# EAGLE design stm-breakout (EAGLE 9.6.2)

## Sheet 1 of 2: STM32
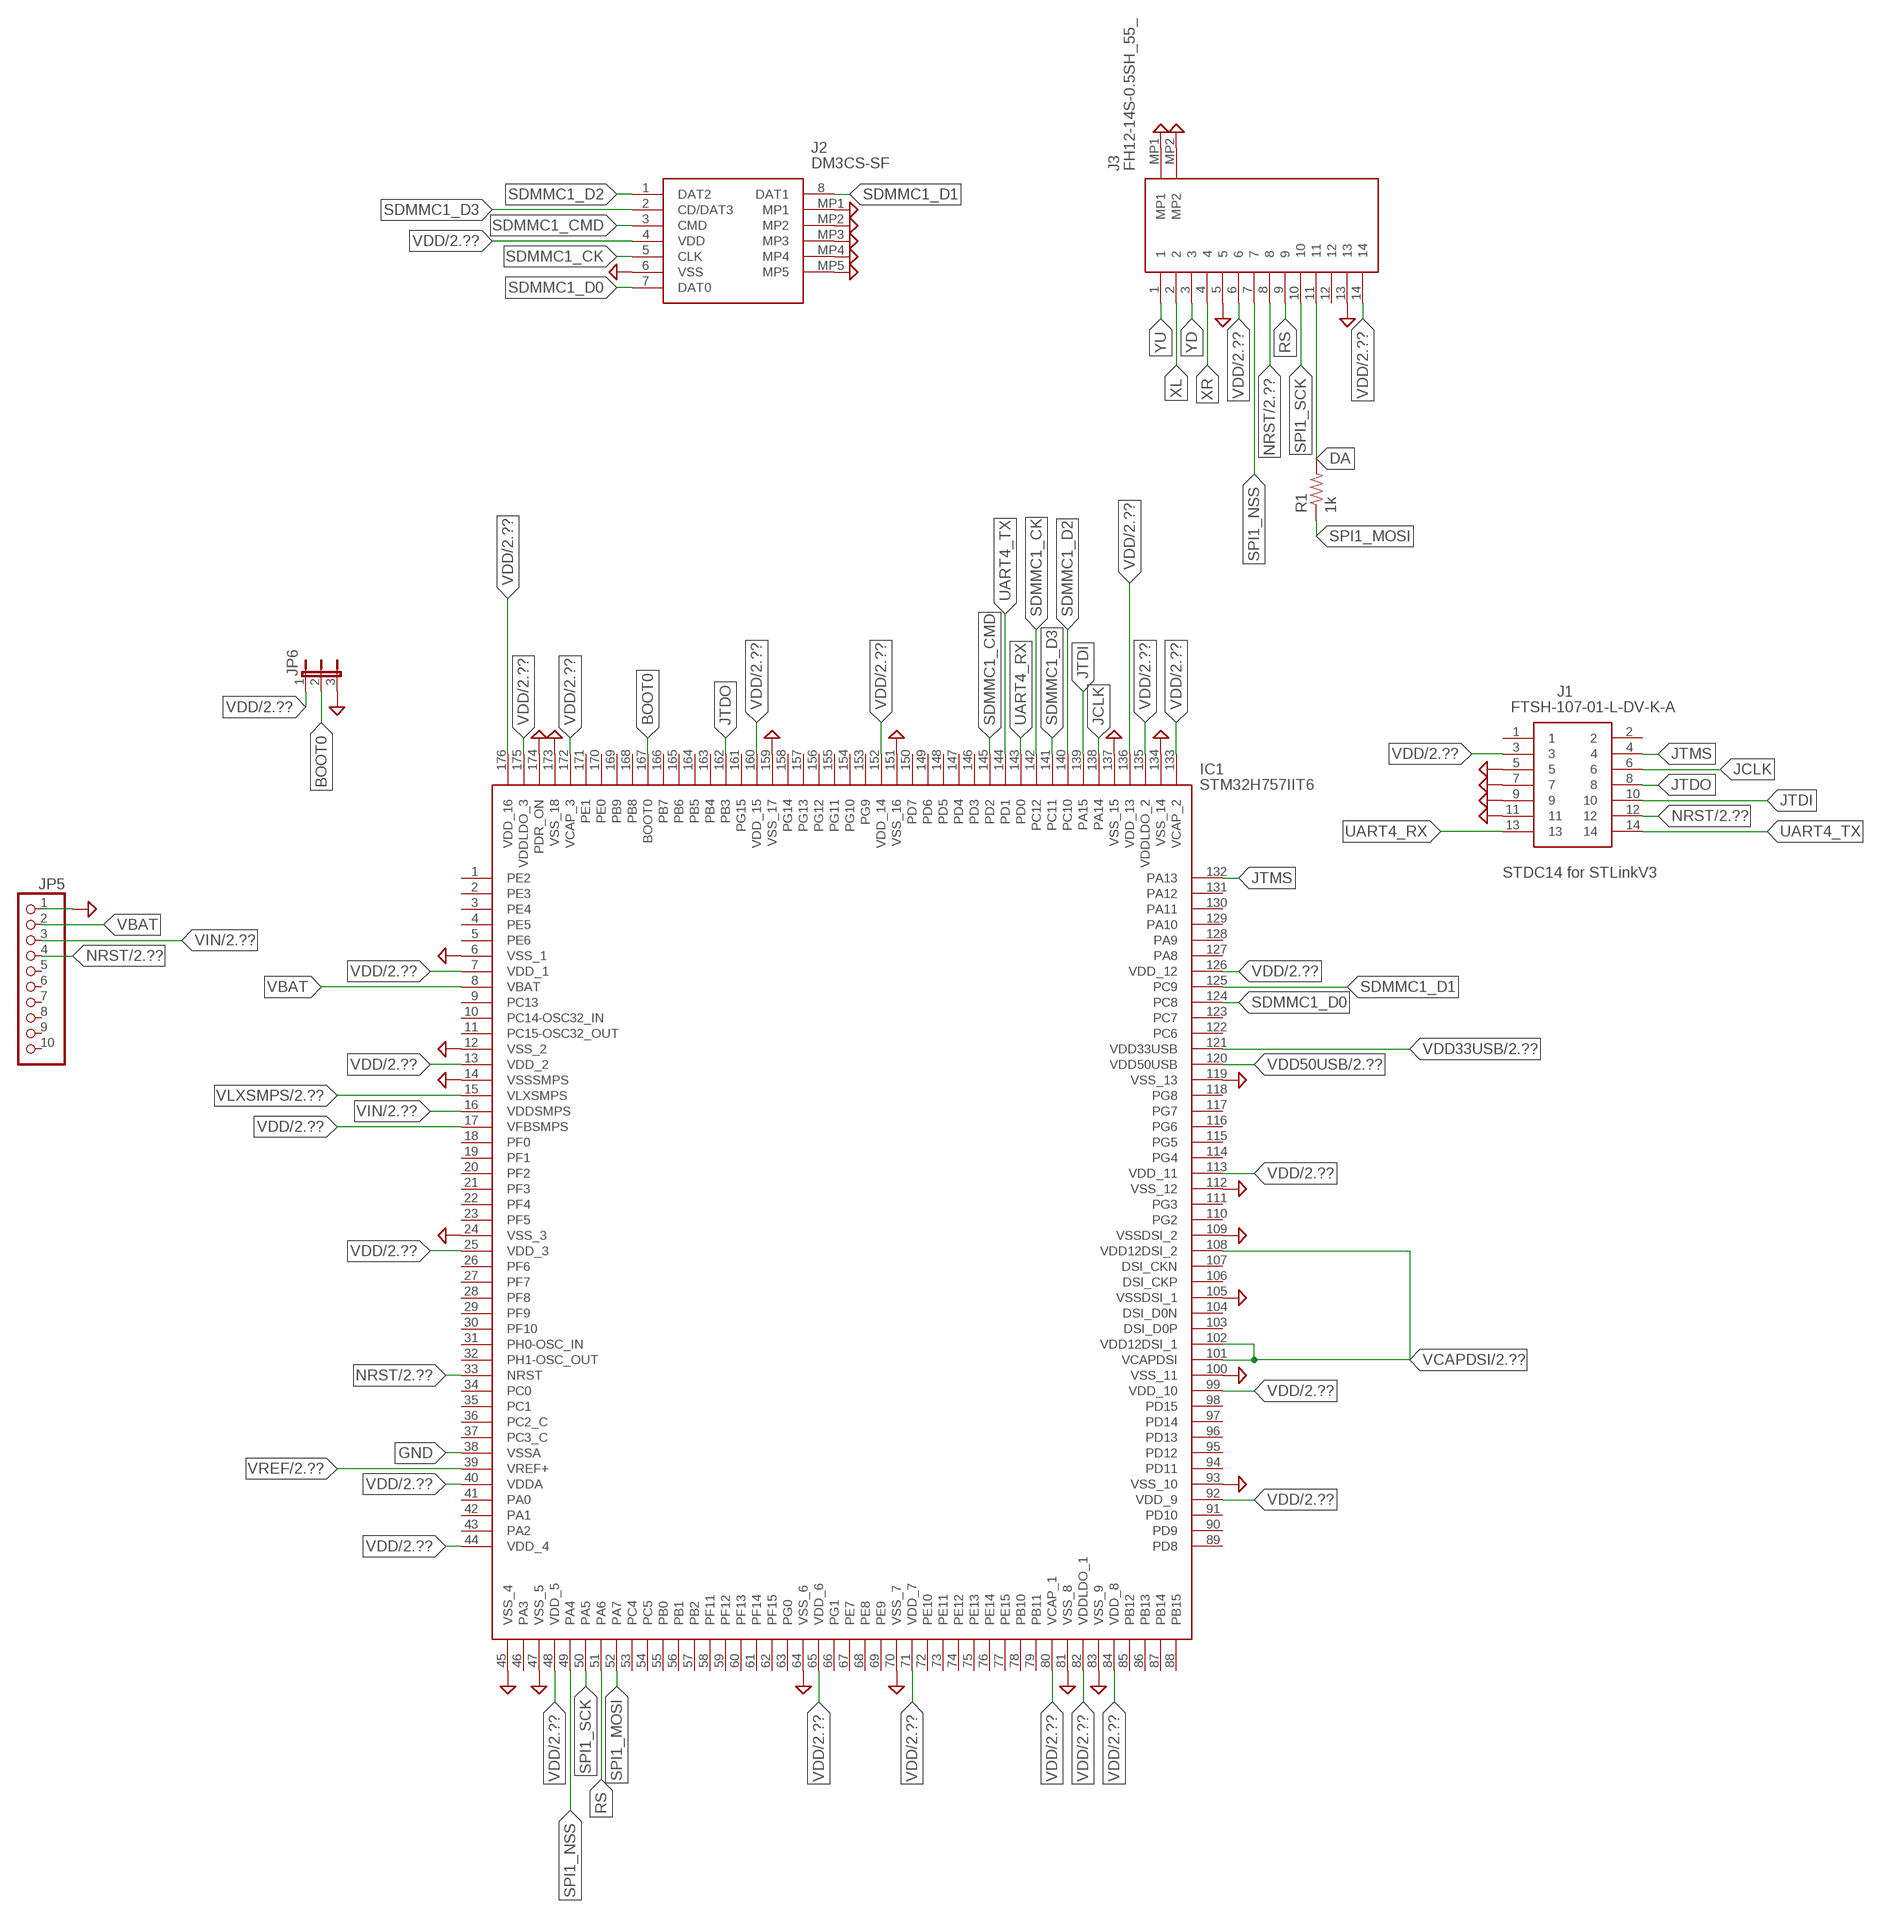
[diagram p0: schematic, sheet 1]

### Parts
IC1  STM32H757IIT6  [QFP50P2600X2600X160-176N]
J1  FTSH-107-01-L-DV-K-A  [FTSH-107-XX-YYY-DV-K-A]
J2  DM3CS-SF  [DM3CSSF]
J3  FH12-14S-0.5SH_55_  [FH1214S05SH55]
JP5  PINHD-1X10  [1X10]
JP6  JP2  [JP2]
R1  1k  R-US_R0402  [R0402]

### Nets
BOOT0: IC1.167(BOOT0) JP6.2
DA: J3.11 R1.2
GND [GND]: IC1.6(VSS_1) IC1.12(VSS_2) IC1.14(VSSSMPS) IC1.24(VSS_3) IC1.38(VSSA) IC1.45(VSS_4) IC1.47(VSS_5) IC1.64(VSS_6) IC1.70(VSS_7) IC1.81(VSS_8) IC1.83(VSS_9) IC1.93(VSS_10) IC1.100(VSS_11) IC1.105(VSSDSI_1) IC1.109(VSSDSI_2) IC1.112(VSS_12) IC1.119(VSS_13) IC1.134(VSS_14) IC1.137(VSS_15) IC1.151(VSS_16) IC1.159(VSS_17) IC1.173(VSS_18) IC1.174(PDR_ON) J1.5 J1.7 J1.9 J1.11 J2.6(VSS) J2.MP1 J2.MP2 J2.MP3 J2.MP4 J2.MP5 J3.5 J3.13 J3.MP1 J3.MP2 JP5.1 JP6.3 ; also sheet 2
JCLK: IC1.138(PA14) J1.6
JTDI: IC1.139(PA15) J1.10
JTDO: IC1.162(PB3) J1.8
JTMS: IC1.132(PA13) J1.4
NRST: IC1.33(NRST) J1.12 J3.8 JP5.4 ; also sheet 2
RS: IC1.51(PA6) J3.9
SDMMC1_CK: IC1.142(PC12) J2.5(CLK)
SDMMC1_CMD: IC1.145(PD2) J2.3(CMD)
SDMMC1_D0: IC1.124(PC8) J2.7(DAT0)
SDMMC1_D1: IC1.125(PC9) J2.8(DAT1)
SDMMC1_D2: IC1.140(PC10) J2.1(DAT2)
SDMMC1_D3: IC1.141(PC11) J2.2(CD/DAT3)
SPI1_MOSI: IC1.52(PA7) R1.1
SPI1_NSS: IC1.49(PA4) J3.7
SPI1_SCK: IC1.50(PA5) J3.10
UART4_RX: IC1.143(PD0) J1.13
UART4_TX: IC1.144(PD1) J1.14
VBAT: IC1.8(VBAT) JP5.2
VCAPDSI: IC1.101(VCAPDSI) IC1.102(VDD12DSI_1) IC1.108(VDD12DSI_2) ; also sheet 2
VDD: IC1.7(VDD_1) IC1.13(VDD_2) IC1.17(VFBSMPS) IC1.25(VDD_3) IC1.40(VDDA) IC1.44(VDD_4) IC1.48(VDD_5) IC1.65(VDD_6) IC1.71(VDD_7) IC1.80(VCAP_1) IC1.82(VDDLDO_1) IC1.84(VDD_8) IC1.92(VDD_9) IC1.99(VDD_10) IC1.113(VDD_11) IC1.126(VDD_12) IC1.133(VCAP_2) IC1.135(VDDLDO_2) IC1.136(VDD_13) IC1.152(VDD_14) IC1.160(VDD_15) IC1.172(VCAP_3) IC1.175(VDDLDO_3) IC1.176(VDD_16) J1.3 J2.4(VDD) J3.6 J3.14 JP6.1 ; also sheet 2
VDD33USB: IC1.121(VDD33USB) ; also sheet 2
VDD50USB: IC1.120(VDD50USB) ; also sheet 2
VIN: IC1.16(VDDSMPS) JP5.3 ; also sheet 2
VLXSMPS: IC1.15(VLXSMPS) ; also sheet 2
VREF: IC1.39(VREF+) ; also sheet 2
XL: J3.2
XR: J3.4
YD: J3.3
YU: J3.1
Unconnected: IC1.1(PE2) IC1.2(PE3) IC1.3(PE4) IC1.4(PE5) IC1.5(PE6) IC1.9(PC13) IC1.10(PC14-OSC32_IN) IC1.11(PC15-OSC32_OUT) IC1.18(PF0) IC1.19(PF1) IC1.20(PF2) IC1.21(PF3) IC1.22(PF4) IC1.23(PF5) IC1.26(PF6) IC1.27(PF7) IC1.28(PF8) IC1.29(PF9) IC1.30(PF10) IC1.31(PH0-OSC_IN) IC1.32(PH1-OSC_OUT) IC1.34(PC0) IC1.35(PC1) IC1.36(PC2_C) IC1.37(PC3_C) IC1.41(PA0) IC1.42(PA1) IC1.43(PA2) IC1.46(PA3) IC1.53(PC4) IC1.54(PC5) IC1.55(PB0) IC1.56(PB1) IC1.57(PB2) IC1.58(PF11) IC1.59(PF12) IC1.60(PF13) IC1.61(PF14) IC1.62(PF15) IC1.63(PG0) IC1.66(PG1) IC1.67(PE7) IC1.68(PE8) IC1.69(PE9) IC1.72(PE10) IC1.73(PE11) IC1.74(PE12) IC1.75(PE13) IC1.76(PE14) IC1.77(PE15) IC1.78(PB10) IC1.79(PB11) IC1.85(PB12) IC1.86(PB13) IC1.87(PB14) IC1.88(PB15) IC1.89(PD8) IC1.90(PD9) IC1.91(PD10) IC1.94(PD11) IC1.95(PD12) IC1.96(PD13) IC1.97(PD14) IC1.98(PD15) IC1.103(DSI_D0P) IC1.104(DSI_D0N) IC1.106(DSI_CKP) IC1.107(DSI_CKN) IC1.110(PG2) IC1.111(PG3) IC1.114(PG4) IC1.115(PG5) IC1.116(PG6) IC1.117(PG7) IC1.118(PG8) IC1.122(PC6) IC1.123(PC7) IC1.127(PA8) IC1.128(PA9) IC1.129(PA10) IC1.130(PA11) IC1.131(PA12) IC1.146(PD3) IC1.147(PD4) IC1.148(PD5) IC1.149(PD6) IC1.150(PD7) IC1.153(PG9) IC1.154(PG10) IC1.155(PG11) IC1.156(PG12) IC1.157(PG13) IC1.158(PG14) IC1.161(PG15) IC1.163(PB4) IC1.164(PB5) IC1.165(PB6) IC1.166(PB7) IC1.168(PB8) IC1.169(PB9) IC1.170(PE0) IC1.171(PE1) J1.1 J1.2 J3.12 JP5.5 JP5.6 JP5.7 JP5.8 JP5.9 JP5.10

### Notes on the sheet
- STDC14 for STLinkV3

## Sheet 2 of 2: Power and Decoupling
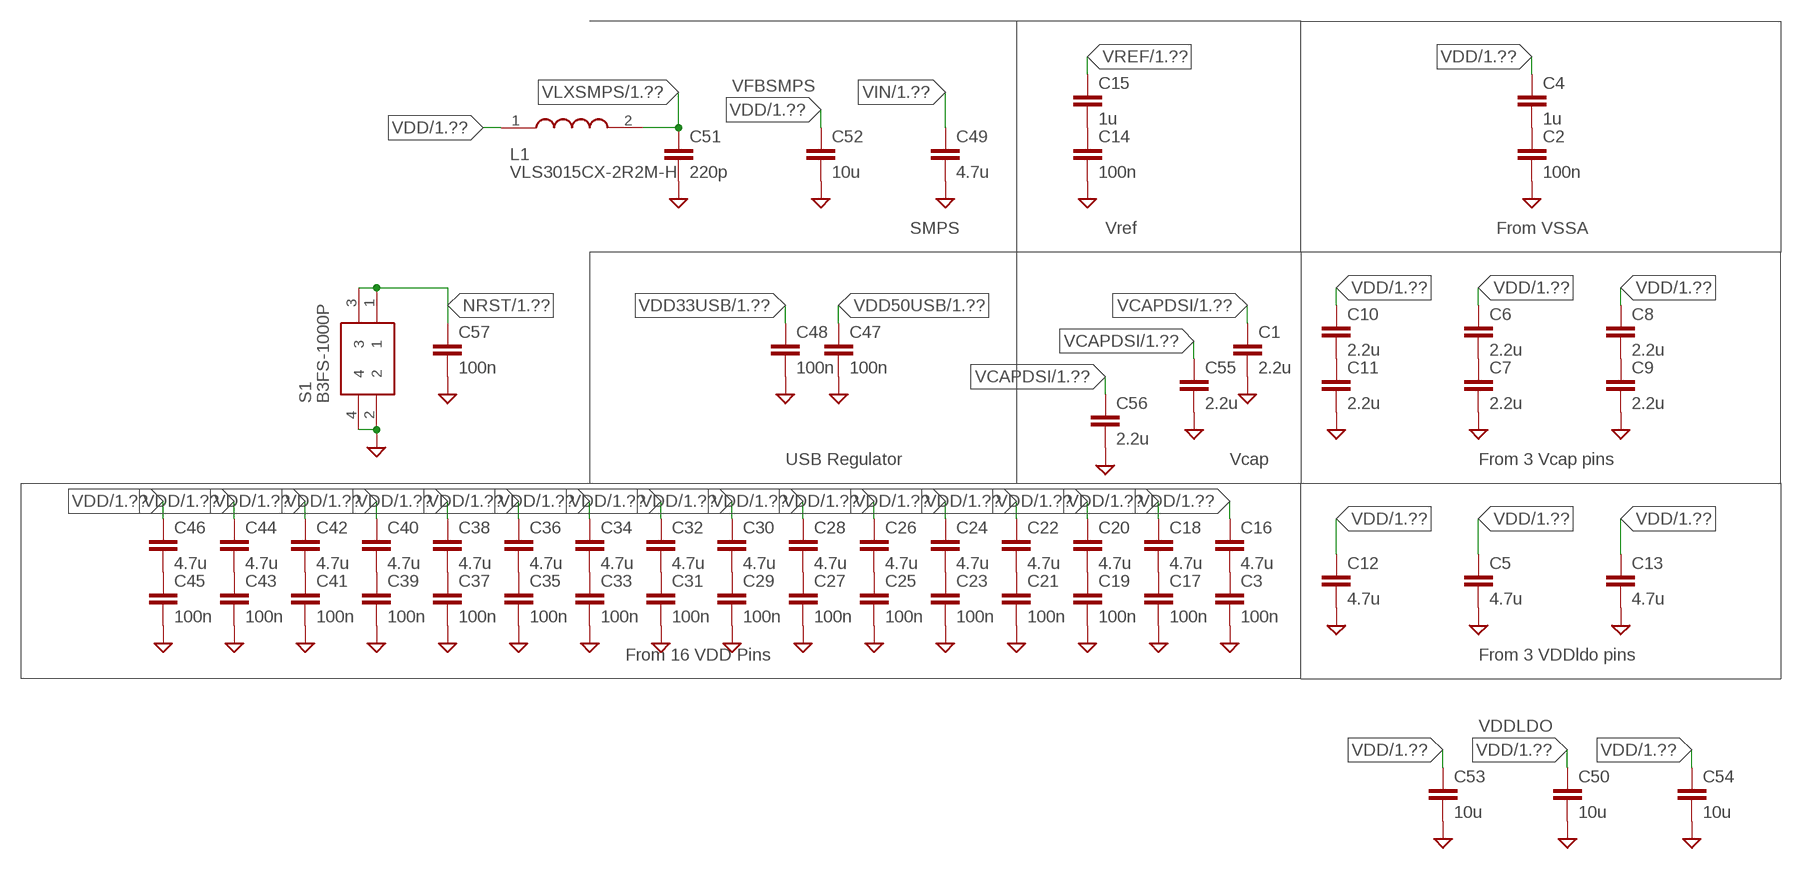
[diagram p1: schematic, sheet 2]

### Parts
C1  2.2u  C-EUC0603  [C0603]
C2  100n  C-EUC0402  [C0402]
C3  100n  C-EUC0402  [C0402]
C4  1u  C-EUC0603  [C0603]
C5  4.7u  C-EUC0603  [C0603]
C6  2.2u  C-EUC0603  [C0603]
C7  2.2u  C-EUC0603  [C0603]
C8  2.2u  C-EUC0603  [C0603]
C9  2.2u  C-EUC0603  [C0603]
C10  2.2u  C-EUC0603  [C0603]
C11  2.2u  C-EUC0603  [C0603]
C12  4.7u  C-EUC0603  [C0603]
C13  4.7u  C-EUC0603  [C0603]
C14  100n  C-EUC0402  [C0402]
C15  1u  C-EUC0603  [C0603]
C16  4.7u  C-EUC0603  [C0603]
C17  100n  C-EUC0402  [C0402]
C18  4.7u  C-EUC0603  [C0603]
C19  100n  C-EUC0402  [C0402]
C20  4.7u  C-EUC0603  [C0603]
C21  100n  C-EUC0402  [C0402]
C22  4.7u  C-EUC0603  [C0603]
C23  100n  C-EUC0402  [C0402]
C24  4.7u  C-EUC0603  [C0603]
C25  100n  C-EUC0402  [C0402]
C26  4.7u  C-EUC0603  [C0603]
C27  100n  C-EUC0402  [C0402]
C28  4.7u  C-EUC0603  [C0603]
C29  100n  C-EUC0402  [C0402]
C30  4.7u  C-EUC0603  [C0603]
C31  100n  C-EUC0402  [C0402]
C32  4.7u  C-EUC0603  [C0603]
C33  100n  C-EUC0402  [C0402]
C34  4.7u  C-EUC0603  [C0603]
C35  100n  C-EUC0402  [C0402]
C36  4.7u  C-EUC0603  [C0603]
C37  100n  C-EUC0402  [C0402]
C38  4.7u  C-EUC0603  [C0603]
C39  100n  C-EUC0402  [C0402]
C40  4.7u  C-EUC0603  [C0603]
C41  100n  C-EUC0402  [C0402]
C42  4.7u  C-EUC0603  [C0603]
C43  100n  C-EUC0402  [C0402]
C44  4.7u  C-EUC0603  [C0603]
C45  100n  C-EUC0402  [C0402]
C46  4.7u  C-EUC0603  [C0603]
C47  100n  C-EUC0402  [C0402]
C48  100n  C-EUC0402  [C0402]
C49  4.7u  C-EUC0603  [C0603]
C50  10u  C-EUC0603  [C0603]
C51  220p  C-EUC0402  [C0402]
C52  10u  C-EUC0603  [C0603]
C53  10u  C-EUC0603  [C0603]
C54  10u  C-EUC0603  [C0603]
C55  2.2u  C-EUC0603  [C0603]
C56  2.2u  C-EUC0603  [C0603]
C57  100n  C-EUC0402  [C0402]
L1  VLS3015CX-2R2M-H  [VLS3015]
S1  B3FS-1000P  [B3FS-1000P]

### Nets
GND [GND]: C1.2 C2.2 C3.2 C5.2 C7.2 C9.2 C11.2 C12.2 C13.2 C14.2 C17.2 C19.2 C21.2 C23.2 C25.2 C27.2 C29.2 C31.2 C33.2 C35.2 C37.2 C39.2 C41.2 C43.2 C45.2 C47.2 C48.2 C49.2 C50.2 C51.2 C52.2 C53.2 C54.2 C55.2 C56.2 C57.2 S1.2 S1.4 ; also sheet 1
N$1: C2.1 C4.2
N$2: C6.2 C7.1
N$3: C8.2 C9.1
N$4: C10.2 C11.1
NRST: C57.1 S1.1 S1.3 ; also sheet 1
VCAPDSI: C1.1 C55.1 C56.1 ; also sheet 1
VDD: C4.1 C5.1 C6.1 C8.1 C10.1 C12.1 C13.1 C16.1 C18.1 C20.1 C22.1 C24.1 C26.1 C28.1 C30.1 C32.1 C34.1 C36.1 C38.1 C40.1 C42.1 C44.1 C46.1 C50.1 C52.1 C53.1 C54.1 L1.1 ; also sheet 1
VDD33USB: C48.1 ; also sheet 1
VDD50USB: C47.1 ; also sheet 1
VIN: C49.1 ; also sheet 1
VLXSMPS: C51.1 L1.2 ; also sheet 1
VREF: C15.1 ; also sheet 1
VREFNF: C14.1 C15.2
VREFNF1: C3.1 C16.2
VREFNF2: C17.1 C18.2
VREFNF3: C19.1 C20.2
VREFNF4: C21.1 C22.2
VREFNF5: C23.1 C24.2
VREFNF6: C25.1 C26.2
VREFNF7: C27.1 C28.2
VREFNF8: C29.1 C30.2
VREFNF9: C31.1 C32.2
VREFNF10: C33.1 C34.2
VREFNF11: C35.1 C36.2
VREFNF12: C37.1 C38.2
VREFNF13: C39.1 C40.2
VREFNF14: C41.1 C42.2
VREFNF15: C43.1 C44.2
VREFNF16: C45.1 C46.2

### Notes on the sheet
- VFBSMPS
- SMPS | Vref | From VSSA
- USB Regulator | Vcap | From 3 Vcap pins
- From 16 VDD Pins | From 3 VDDldo pins
- VDDLDO

## Library data of the parts
C1-C57 = rcl:C-EU: CAPACITOR, European symbol; SPICEPREFIX: C
IC1 = SamacSys_Parts:STM32H757IIT6: ARM Microcontrollers - MCU 16/32-BITS MICROS Source: Datasheet <https://www.st.com/resource/en/datasheet/stm32h757ai.pdf>; DESCRIPTION: ARM Microcontrollers - MCU 16/32-BITS MICROS; HEIGHT: 1.6mm; MANUFACTURER_NAME: STMicroelectronics; MANUFACTURER_PART_NUMBER: STM32H757IIT6; MOUSER_PART_NUMBER: 511-STM32H757IIT6; MOUSER_PRICE-STOCK: https://www.mouser.co.uk/ProductDetail/STMicroelectronics/STM32H757IIT6?qs=vLWxofP3U2wz9EzH5pjPxQ%3D%3D
J1 = SamacSys_Parts:FTSH-107-01-L-DV-K-A: 14 position, High Reliability Header Strips, 0.050" pitch, Dual-Row Vertical Source: Datasheet <http://suddendocs.samtec.com/prints/ftsh-1xx-xx-xxx-dv-xxx-xxx-mkt.pdf>; DESCRIPTION: 14 position, High Reliability Header Strips, 0.050&quot; pitch, Dual-Row Vertical; HEIGHT: mm; MANUFACTURER_NAME: SAMTEC; MANUFACTURER_PART_NUMBER: FTSH-107-01-L-DV-K-A; MOUSER_PART_NUMBER: 200-FTSH10701LDVKA; MOUSER_PRICE-STOCK: https://www.mouser.co.uk/ProductDetail/Samtec/FTSH-107-01-L-DV-K-A?qs=PB6%2FjmICvI3xEHFou4PhNg%3D%3D
J2 = SamacSys_Parts:DM3CS-SF: Memory Card Connectors 8P R/A SMT MICRO SD HINGE PUSH-PULL Source: Datasheet <https://datasheet.lcsc.com/szlcsc/Hirose-HRS-DM3CS-SF_C202111.pdf>; DESCRIPTION: Memory Card Connectors 8P R/A SMT MICRO SD HINGE PUSH-PULL; HEIGHT: 1.83mm; MANUFACTURER_NAME: Hirose; MANUFACTURER_PART_NUMBER: DM3CS-SF; MOUSER_PART_NUMBER: 798-DM3CSSF; MOUSER_PRICE-STOCK: https://www.mouser.co.uk/ProductDetail/Hirose-Connector/DM3CS-SF?qs=tTj%252BmQ3KZwbB9K5zh89Rcw%3D%3D
J3 = SamacSys_Parts:FH12-14S-0.5SH_55_: Hirose FH12 Series 0.5mm Pitch 14 Way 1 Row Right Angle SMT Female FPC Connector, Gold Plated Contacts Source: Datasheet <https://www.hirose.com/product/document?clcode=&productname=&series=FH12&documenttype=Catalog&lang=en&documentid=D31648_en>; DESCRIPTION: Hirose FH12 Series 0.5mm Pitch 14 Way 1 Row Right Angle SMT Female FPC Connector, Gold Plated Contacts; HEIGHT: 2mm; MANUFACTURER_NAME: Hirose; MANUFACTURER_PART_NUMBER: FH12-14S-0.5SH(55); MOUSER_PART_NUMBER: 798-FH12-14S-05SH55; MOUSER_PRICE-STOCK: https://www.mouser.co.uk/ProductDetail/Hirose-Connector/FH12-14S-05SH55?qs=0N%252BVULUZFj%2F0fj5Q2as8Zg%3D%3D
JP5 = pinhead:PINHD-1X10: PIN HEADER
JP6 = SamacSys_Parts:JP2: JUMPER
L1 = SamacSys_Parts:VLS3015CX-2R2M-H: SMD / SMT Inductors (Coils), L=2.2?H, L x W x T : Source: Datasheet <https://product.tdk.com/system/files/dam/doc/product/inductor/inductor/smd/catalog/inductor_automotive_power_vls3015cx-h_en.pdf>; DESCRIPTION: SMD / SMT Inductors (Coils), L=2.2?H, L x W x T :; HEIGHT: mm; MANUFACTURER_NAME: TDK; MANUFACTURER_PART_NUMBER: VLS3015CX-2R2M-H; MOUSER_PART_NUMBER: 810-VLS3015CX-2R2M-H; MOUSER_PRICE-STOCK: https://www.mouser.co.uk/ProductDetail/TDK/VLS3015CX-2R2M-H?qs=zW32dvEIR3uMKTZetq6xLg%3D%3D
R1 = rcl:R-US_: RESISTOR, American symbol; SPICEPREFIX: R
S1 = SamacSys_Parts:B3FS-1000P: Switch Tact,6x6mm,flat act,gen purp,tape Plunger Tactile Switch, SPST-NO 0.05 A@ 24 V dc 0.5mm Source: Datasheet <https://www.omron.co.jp/ecb/products/pdf/b3fs.pdf>; DESCRIPTION: Switch Tact,6x6mm,flat act,gen purp,tape Plunger Tactile Switch, SPST-NO 0.05 A@ 24 V dc 0.5mm; HEIGHT: mm; MANUFACTURER_NAME: Omron Electronics; MANUFACTURER_PART_NUMBER: B3FS-1000P; MOUSER_PART_NUMBER: 653-B3FS-1000P; MOUSER_PRICE-STOCK: https://www.mouser.co.uk/ProductDetail/Omron-Electronics/B3FS-1000P?qs=ImaqFqjHA4k6odVF2%2FXWpQ%3D%3D

## Board
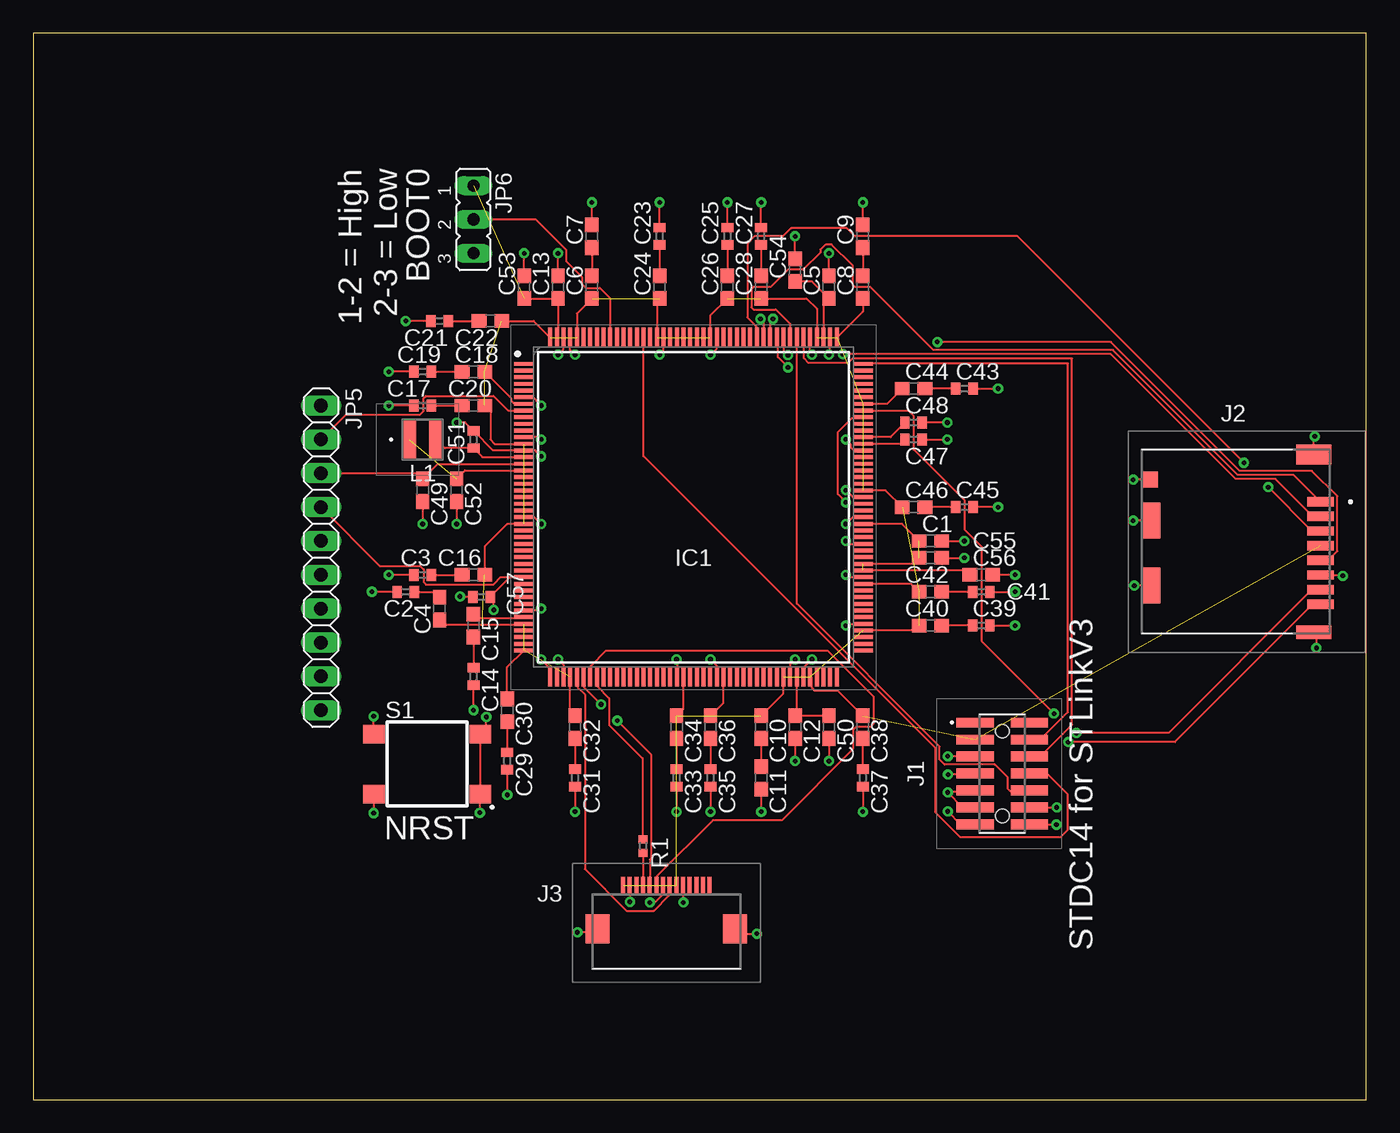
[diagram p2: board, top side]
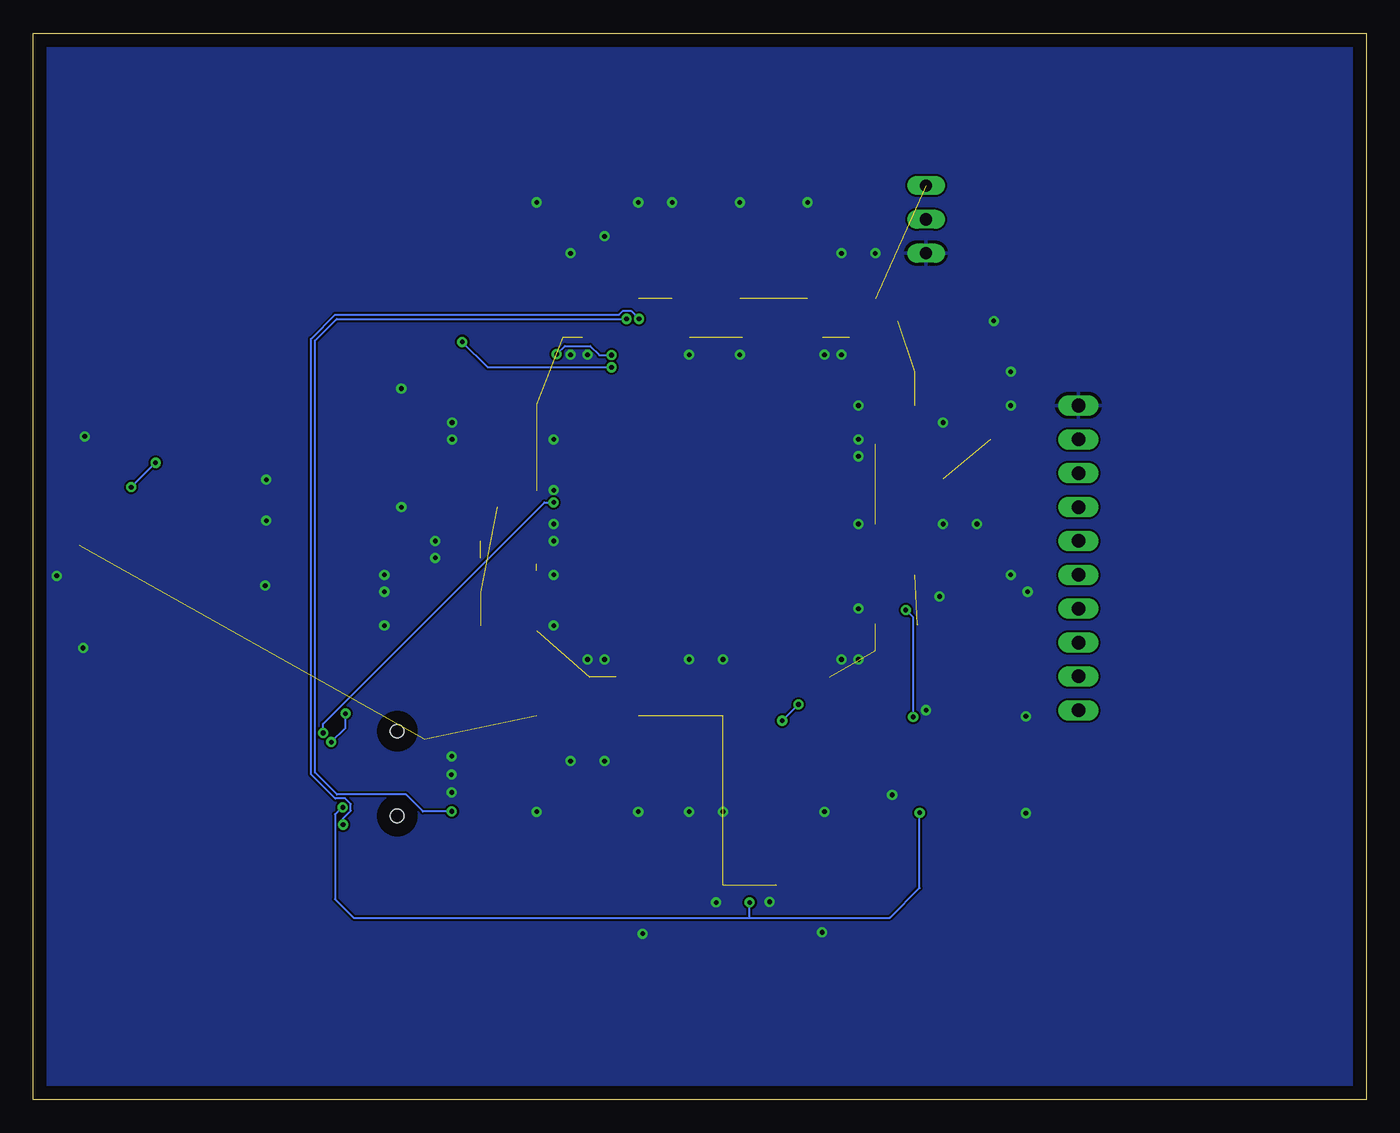
[diagram p3: board, bottom side, seen from below]

Size 100 x 80 mm. Coordinates in mm from the lower left corner, seen from the top.
Outline: 0,0 100,0 100,80 0,80 0,0
Copper layers (1*16): Top 0.035mm / dielectric 1.5mm / Bottom 0.035mm
Design rules "default": minimum track width 6mil, minimum drill 0.35mm, track to track 6mil, track to pad 6mil, pad to pad 6mil, via to via 6mil, smd to smd 6mil, copper to edge 40mil, drill to drill 6mil, minimum pad ring 10mil, minimum via ring 8mil, stop-mask expansion 4mil, vias tented up to drill 0mil, thermal gap 10mil

### Footprints (pad centres in the part's own frame; a part is rotated, then mirrored left to right if it is on the bottom)
C0603 = smd 1.1 x 1: 1 -0.85,0; 2 0.85,0
C0402 = smd 0.7 x 0.9: 1 -0.65,0; 2 0.65,0
QFP50P2600X2600X160-176N = smd 1.45 x 0.3: 1 -12.725,10.75; 2 -12.725,10.25; 3 -12.725,9.75; 4 -12.725,9.25; 5 -12.725,8.75; 6 -12.725,8.25; 7 -12.725,7.75; 8 -12.725,7.25; 9 -12.725,6.75; 10 -12.725,6.25; 11 -12.725,5.75; 12 -12.725,5.25; 13 -12.725,4.75; 14 -12.725,4.25; 15 -12.725,3.75; 16 -12.725,3.25; 17 -12.725,2.75; 18 -12.725,2.25; 19 -12.725,1.75; 20 -12.725,1.25; 21 -12.725,0.75; 22 -12.725,0.25; 23 -12.725,-0.25; 24 -12.725,-0.75; 25 -12.725,-1.25; 26 -12.725,-1.75; 27 -12.725,-2.25; 28 -12.725,-2.75; 29 -12.725,-3.25; 30 -12.725,-3.75; 31 -12.725,-4.25; 32 -12.725,-4.75; 33 -12.725,-5.25; 34 -12.725,-5.75; 35 -12.725,-6.25; 36 -12.725,-6.75; 37 -12.725,-7.25; 38 -12.725,-7.75; 39 -12.725,-8.25; 40 -12.725,-8.75; 41 -12.725,-9.25; 42 -12.725,-9.75; 43 -12.725,-10.25; 44 -12.725,-10.75; 89 12.725,-10.75; 90 12.725,-10.25; 91 12.725,-9.75; 92 12.725,-9.25; 93 12.725,-8.75; 94 12.725,-8.25; 95 12.725,-7.75; 96 12.725,-7.25; 97 12.725,-6.75; 98 12.725,-6.25; 99 12.725,-5.75; 100 12.725,-5.25; 101 12.725,-4.75; 102 12.725,-4.25; 103 12.725,-3.75; 104 12.725,-3.25; 105 12.725,-2.75; 106 12.725,-2.25; 107 12.725,-1.75; 108 12.725,-1.25; 109 12.725,-0.75; 110 12.725,-0.25; 111 12.725,0.25; 112 12.725,0.75; 113 12.725,1.25; 114 12.725,1.75; 115 12.725,2.25; 116 12.725,2.75; 117 12.725,3.25; 118 12.725,3.75; 119 12.725,4.25; 120 12.725,4.75; 121 12.725,5.25; 122 12.725,5.75; 123 12.725,6.25; 124 12.725,6.75; 125 12.725,7.25; 126 12.725,7.75; 127 12.725,8.25; 128 12.725,8.75; 129 12.725,9.25; 130 12.725,9.75; 131 12.725,10.25; 132 12.725,10.75 | smd 0.3 x 1.45: 45 -10.75,-12.725; 46 -10.25,-12.725; 47 -9.75,-12.725; 48 -9.25,-12.725; 49 -8.75,-12.725; 50 -8.25,-12.725; 51 -7.75,-12.725; 52 -7.25,-12.725; 53 -6.75,-12.725; 54 -6.25,-12.725; 55 -5.75,-12.725; 56 -5.25,-12.725; 57 -4.75,-12.725; 58 -4.25,-12.725; 59 -3.75,-12.725; 60 -3.25,-12.725; 61 -2.75,-12.725; 62 -2.25,-12.725; 63 -1.75,-12.725; 64 -1.25,-12.725; 65 -0.75,-12.725; 66 -0.25,-12.725; 67 0.25,-12.725; 68 0.75,-12.725; 69 1.25,-12.725; 70 1.75,-12.725; 71 2.25,-12.725; 72 2.75,-12.725; 73 3.25,-12.725; 74 3.75,-12.725; 75 4.25,-12.725; 76 4.75,-12.725; 77 5.25,-12.725; 78 5.75,-12.725; 79 6.25,-12.725; 80 6.75,-12.725; 81 7.25,-12.725; 82 7.75,-12.725; 83 8.25,-12.725; 84 8.75,-12.725; 85 9.25,-12.725; 86 9.75,-12.725; 87 10.25,-12.725; 88 10.75,-12.725; 133 10.75,12.725; 134 10.25,12.725; 135 9.75,12.725; 136 9.25,12.725; 137 8.75,12.725; 138 8.25,12.725; 139 7.75,12.725; 140 7.25,12.725; 141 6.75,12.725; 142 6.25,12.725; 143 5.75,12.725; 144 5.25,12.725; 145 4.75,12.725; 146 4.25,12.725; 147 3.75,12.725; 148 3.25,12.725; 149 2.75,12.725; 150 2.25,12.725; 151 1.75,12.725; 152 1.25,12.725; 153 0.75,12.725; 154 0.25,12.725; 155 -0.25,12.725; 156 -0.75,12.725; 157 -1.25,12.725; 158 -1.75,12.725; 159 -2.25,12.725; 160 -2.75,12.725; 161 -3.25,12.725; 162 -3.75,12.725; 163 -4.25,12.725; 164 -4.75,12.725; 165 -5.25,12.725; 166 -5.75,12.725; 167 -6.25,12.725; 168 -6.75,12.725; 169 -7.25,12.725; 170 -7.75,12.725; 171 -8.25,12.725; 172 -8.75,12.725; 173 -9.25,12.725; 174 -9.75,12.725; 175 -10.25,12.725; 176 -10.75,12.725
FTSH-107-XX-YYY-DV-K-A = smd 0.74 x 2.79: 1 -3.81,-2.035; 2 -3.81,2.035; 3 -2.54,-2.035; 4 -2.54,2.035; 5 -1.27,-2.035; 6 -1.27,2.035; 7 0,-2.035; 8 0,2.035; 9 1.27,-2.035; 10 1.27,2.035; 11 2.54,-2.035; 12 2.54,2.035; 13 3.81,-2.035; 14 3.81,2.035 | hole 1.02: -3.175,0; 3.175,0
DM3CSSF = smd 0.7 x 2: 1 3,-6.35; 2 1.9,-6.35; 3 0.8,-6.35; 4 -0.3,-6.35; 5 -1.4,-6.35; 6 -2.5,-6.35; 7 -3.6,-6.35; 8 -4.7,-6.35 | smd 1 x 2.6: MP1 -6.8,-5.85 | smd 1.5 x 2.6: MP2 6.55,-5.85 | smd 2.7 x 1.4: MP3 -3.3,6.35; MP4 1.6,6.35 | smd 1.2 x 1.2: MP5 4.65,6.45
FH1214S05SH55 = smd 0.3 x 1.3: 1 -3.25,-3.125; 2 -2.75,-3.125; 3 -2.25,-3.125; 4 -1.75,-3.125; 5 -1.25,-3.125; 6 -0.75,-3.125; 7 -0.25,-3.125; 8 0.25,-3.125; 9 0.75,-3.125; 10 1.25,-3.125; 11 1.75,-3.125; 12 2.25,-3.125; 13 2.75,-3.125; 14 3.25,-3.125 | smd 1.8 x 2.2: MP1 -5.15,0.125; MP2 5.15,0.125
1X10 = drill 1.016 long: 1 -11.43,0; 2 -8.89,0; 3 -6.35,0; 4 -3.81,0; 5 -1.27,0; 6 1.27,0; 7 3.81,0; 8 6.35,0; 9 8.89,0; 10 11.43,0
JP2 = drill 0.914 long: 1 -2.54,0; 2 0,0; 3 2.54,0
VLS3015 = smd 1 x 3: 1 -1,0; 2 1,0
R0402 = smd 0.6 x 0.7: 1 -0.5,0; 2 0.5,0
B3FS-1000P = smd 1.6 x 1.4: 1 4,-2.25; 2 -4,-2.25; 3 4,2.25; 4 -4,2.25

### Placement (x,y rotation side)
C1  67.31,41.91 0 top
C2  27.94,38.1 180 top
C3  29.21,39.37 180 top
C4  30.48,36.83 90 top
C5  59.69,60.96 90 top
C6  41.91,60.96 90 top
C7  41.91,64.77 90 top
C8  62.23,60.96 90 top
C9  62.23,64.77 90 top
C10  54.61,27.94 270 top
C11  54.61,24.13 270 top
C12  57.15,27.94 270 top
C13  39.37,60.96 90 top
C14  33.02,31.75 270 top
C15  33.02,35.56 270 top
C16  33.02,39.37 180 top
C17  29.21,54.61 180 top
C18  33.02,54.61 180 top
C19  29.21,52.07 180 top
C20  33.02,52.07 180 top
C21  30.48,58.42 180 top
C22  34.29,58.42 180 top
C23  46.99,64.77 90 top
C24  46.99,60.96 90 top
C25  52.07,64.77 90 top
C26  52.07,60.96 90 top
C27  54.61,64.77 90 top
C28  54.61,60.96 90 top
C29  35.56,25.4 270 top
C30  35.56,29.21 270 top
C31  40.64,24.13 270 top
C32  40.64,27.94 270 top
C33  48.26,24.13 270 top
C34  48.26,27.94 270 top
C35  50.8,24.13 270 top
C36  50.8,27.94 270 top
C37  62.23,24.13 270 top
C38  62.23,27.94 270 top
C39  71.12,35.56 0 top
C40  67.31,35.56 0 top
C41  71.12,38.1 0 top
C42  67.31,38.1 0 top
C43  69.85,53.34 0 top
C44  66.04,53.34 0 top
C45  69.85,44.45 0 top
C46  66.04,44.45 0 top
C47  66.04,49.53 0 top
C48  66.04,50.8 0 top
C49  29.21,45.72 270 top
C50  59.69,27.94 270 top
C51  33.02,49.53 90 top
C52  31.75,45.72 270 top
C53  36.83,60.96 90 top
C54  57.15,62.23 90 top
C55  67.31,40.64 0 top
C56  71.12,39.37 0 top
C57  33.63,37.72 180 top
IC1  49.53,44.45 0 top
J1  72.69,24.46 270 top
J2  90.22,41.86 90 top
J3  47.5,12.93 180 top
JP5  21.59,40.64 270 top
JP6  33.02,66.04 270 top
L1  29.21,49.53 0 top
R1  45.75,19.02 270 top
S1  29.54,25.17 0 top

### Tracks (layer width: path | path; a pad name or v marks a point on that pad's centre or on a via)
BOOT0
  Top 0.152: JP6.2 37.69,66.04 39.98,63.75 39.98,62.89 41.18,61.69 41.18,61.16 41.46,60.89 42.51,60.89 43.28,60.11 IC1.167
DA
  Top 0.152: R1.2 J3.11
GND  (via drill 0.35)
  Top 0.152: C2.2 v25.4,38.1 | C21.2 v27.94,58.42 | C17.2 v26.67,54.61 | C19.2 v26.67,52.07 | v31.75,50.8 32.4,50.8 C51.2 34.5,48.7 IC1.14 37.66,48.7 v38.1,48.26 | C49.2 v29.21,43.18 | C52.2 v31.75,43.18 | C3.2 v26.67,39.37 | v33.02,29.21 C14.2 | C29.2 v35.56,22.86 | C31.2 v40.64,21.59 | C33.2 v48.26,21.59 | C35.2 v50.8,21.59 | C11.2 v54.61,21.59 | C12.2 v57.15,25.4 | C50.2 v59.69,25.4 | C37.2 v62.23,21.59 | C39.2 v73.66,35.56 | C41.2 v73.66,38.1 | v73.66,39.37 C56.2 | C55.2 v69.85,40.64 | C1.2 v69.85,41.91 | v72.39,44.45 C45.2 | C47.2 v68.58,49.53 | v68.58,50.8 C48.2 | C43.2 v72.39,53.34 | C9.2 v62.23,67.31 | C5.2 v59.69,63.5 | C54.2 v57.15,64.77 | C27.2 v54.61,67.31 | C53.2 v36.83,63.5 | C13.2 v39.37,63.5 | C7.2 v41.91,67.31 | C23.2 v46.99,67.31 | C25.2 v52.07,67.31 | v60.96,49.53 61.3,49.19 61.3,48.95 61.56,48.7 IC1.119 | v60.96,41.91 61.17,41.7 IC1.105 | v60.96,43.18 61.48,43.7 IC1.109 | v60.96,45.72 61.48,45.2 IC1.112 | v60.96,39.37 61.13,39.2 IC1.100 | v60.96,35.56 61.1,35.7 IC1.93 | v58.42,33.02 58.08,32.68 58.03,32.68 57.78,32.42 IC1.83 | v57.15,33.02 56.78,32.65 IC1.81 | v50.8,33.02 51.28,32.54 IC1.70 | v48.26,33.02 48.28,33 IC1.64 | v39.37,33.02 39.78,32.61 IC1.47 | v38.1,33.02 38.78,32.34 IC1.45 | v38.1,36.83 37.97,36.7 IC1.38 | v38.1,43.18 37.58,43.7 IC1.24 | v38.1,52.07 37.76,52.41 37.76,52.45 37.5,52.7 IC1.6 | v38.1,49.53 37.93,49.7 IC1.12 | v40.64,55.88 40.28,56.24 IC1.173 | v46.99,55.88 47.28,56.17 IC1.159 | v50.8,55.88 51.28,56.36 IC1.151 | v58.42,55.88 58.28,56.02 IC1.137 | v59.69,55.88 59.78,55.97 IC1.134 | v39.37,55.88 39.78,56.29 IC1.174 | v32,37.74 32.95,37.74 C57.2 | S1.4 25.53,27.43 v25.53,28.75 | S1.2 25.54,21.5 v25.53,21.49 | J1.7 70.58,24.38 v68.63,24.38
  Top 0.152: J1.5 68.63,25.73 v68.61,25.76 | J1.9 70.56,23.09 68.66,23.09 v68.61,23.04 69.72,21.92 J1.11 | J2.MP5 v82.53,46.51 | J2.MP4 82.55,43.46 v82.53,43.43 | J2.MP3 v82.6,38.56 | J2.MP1 96.27,34.86 v96.27,33.88 | J2.MP2 96.07,49.69 v96.14,49.76 | J2.6 98.18,39.36 v98.25,39.29 | J3.MP2 42.09,12.55 v40.82,12.55 | J3.MP1 53.01,12.45 v54.28,12.45 | J3.13 v44.76,14.83 | J3.5 48.75,14.8 v48.77,14.78
  pour Bottom: 0,80.01 0,0 100.33,0 100.33,80.01
JCLK
  Top 0.152: J1.6 74.74,25.72 75.53,25.72 77.93,28.11 77.93,55.6 61.46,55.6 61.13,55.27 58.17,55.27 57.81,55.63 57.81,57.14 IC1.138
JTDI
  Top 0.152: J1.10 74.5,22.96 73.45,22.96 73.11,23.31 73.11,24.15 72.13,25.13 68.37,25.13 68,25.5 68,26.49 57.28,37.21 IC1.139
JTDO
  Top 0.152: IC1.162 45.78,48.28 67.69,26.36 67.69,21.53 69.54,19.68 77.07,19.68 77.57,20.19 77.57,22.94 76.04,24.48 74.74,24.48 J1.8
JTMS
  Top 0.152: J1.4 74.97,27.24 75.79,27.24 77.62,29.07 77.62,55.22 62.27,55.22 IC1.132
N$1
  Top 0.152: C2.1 30.06,38.1 C4.2
N$2
  Top 0.152: C7.1 C6.2
N$3
  Top 0.152: C9.1 C8.2
N$4
  Top 0.152: C10.2 C11.1
NRST  (via drill 0.35)
  Top 0.152: v33.98,28.7 33.98,27.87 S1.3 S1.1 33.5,22.88 v33.5,21.51 | v34.54,36.73 34.54,37.45 C57.1 35.76,39.2 IC1.33 35.07,39.2 34.52,38.64 29.46,38.64 29.28,38.83 29.28,39.77 29,40.05 25.99,40.05 JP5.4 | J1.12 v76.78,21.92 | v46.25,14.78 46.63,14.78 47.24,15.39 47.24,16 J3.8
  Bottom 0.152: v33.98,28.7 33.98,36.17 v34.54,36.73 | v76.78,21.92 76.86,21.92 77.37,21.41 77.37,15.03 75.97,13.64 46.25,13.64 | 46.25,13.64 35.74,13.64 33.5,15.88 v33.5,21.51 | 46.25,13.64 v46.25,14.78
RS
  Top 0.152: J3.9 46.79,16.08 46.79,16.76 50.98,20.95 56.16,20.95 61.49,26.29 61.49,27.74 61.72,27.96 62.79,27.96 63.02,28.19 63.02,30.25 59.59,33.68 42.98,33.68 41.83,32.54 41.83,31.77 IC1.51
SDMMC1_CK  (via drill 0.35)
  Top 0.152: v56.62,54.94 55.85,55.7 55.85,57.15 IC1.142 | v67.82,56.84 80.85,56.84 90.53,47.17 95.94,47.17 97.84,45.26 97.84,41.15 97.16,40.46 96.62,40.46 J2.5
  Bottom 0.152: v56.62,54.94 65.91,54.94 v67.82,56.84
SDMMC1_CMD  (via drill 0.35)
  Top 0.152: v90.83,47.78 73.84,64.77 61.65,64.77 61.04,65.38 56.84,65.38 56.24,64.77 54.1,64.77 53.57,64.24 53.57,58.67 54.25,57.99 54.25,57.23 IC1.145 | v92.66,45.95 95.94,42.67 96.55,42.67 J2.3
  Bottom 0.152: v92.66,45.95 v90.83,47.78
SDMMC1_D0  (via drill 0.35)
  Top 0.152: v60.96,44.81 60.35,45.41 60.35,50.06 61.42,51.13 62.18,51.13 IC1.124 | v78.26,27.51 85.19,27.51 95.94,38.25 96.55,38.25 J2.7
  Bottom 0.152: v60.96,44.81 61.65,44.81 78.26,28.19 v78.26,27.51
SDMMC1_D1  (via drill 0.35)
  Top 0.152: v76.58,28.96 71.17,34.37 71.17,41.45 69.88,42.75 69.88,44.96 66.06,48.77 66.06,51.28 65.68,51.66 62.26,51.66 IC1.125 | v77.65,26.82 85.65,26.82 95.94,37.11 96.55,37.11 J2.8
  Bottom 0.152: v76.58,28.96 76.58,27.89 v77.65,26.82
SDMMC1_D2
  Top 0.152: IC1.140 56.77,57.23 56.77,58.22 55.7,59.28 54.03,59.28 53.87,59.44 53.87,60.81 54.03,60.96 55.32,60.96 56.62,62.26 57.76,62.26 59.05,63.55 59.05,63.78 59.44,64.16 59.89,64.16 61.49,62.56 61.49,61.11 61.65,60.96 62.79,60.96 67.51,56.24 81,56.24 90.37,46.86 94.56,46.86 96.55,44.88 J2.1
SDMMC1_D3  (via drill 0.35)
  Top 0.152: v56.62,55.85 56.31,56.16 56.31,57.15 IC1.141 | v60.73,55.93 80.85,55.93 90.22,46.56 93.19,46.56 95.94,43.81 96.55,43.81 J2.2
  Bottom 0.152: v56.62,55.85 57.53,55.85 58.22,56.54 60.12,56.54 v60.73,55.93
SPI1_MOSI
  Top 0.152: R1.1 45.72,19.58 45.72,25.6 43.2,28.12 43.2,30.1 42.29,31.01 42.29,31.7 IC1.52
SPI1_NSS
  Top 0.152: J3.7 47.7,16 47.7,15.32 46.56,14.17 44.5,14.17 41.38,17.3 41.38,30.4 40.84,30.94 40.84,31.7 IC1.49
SPI1_SCK  (via drill 0.35)
  Top 0.152: v43.81,28.42 46.33,25.91 46.33,18.06 46.25,17.98 46.25,16.08 J3.10 | v42.6,29.64 41.3,30.94 41.3,31.7 IC1.50
  Bottom 0.152: v42.6,29.64 v43.81,28.42
UART4_RX  (via drill 0.35)
  Top 0.152: J1.13 69.57,20.65 v68.61,21.61 | v55.5,58.57 55.28,58.35 IC1.143
  Bottom 0.152: v68.61,21.61 70.76,21.61 72.03,22.89 77.22,22.89 78.87,24.54 78.87,56.95 77.24,58.57 v55.5,58.57
UART4_TX  (via drill 0.35)
  Top 0.152: J1.14 76.73,20.65 v76.76,20.62 | v54.56,58.57 54.78,58.35 IC1.144
  Bottom 0.152: v76.76,20.62 76.76,21.09 76.18,21.67 76.18,22.17 76.59,22.58 77.34,22.58 79.17,24.41 79.17,57.07 77.37,58.88 56.05,58.88 55.75,59.18 55.17,59.18 v54.56,58.57
VBAT
  Top 0.152: IC1.8 35.61,51.7 34.52,52.8 29.46,52.8 29.28,52.62 29.28,51.67 29,51.39 23.45,51.39 JP5.2
VCAPDSI  (2 unrouted)
  Top 0.152: C1.1 65.17,43.2 IC1.108 | C55.1 66.02,40.2 IC1.102 | C56.1 69.94,39.7 IC1.101
VDD  (30 unrouted)
  Top 0.152: C53.1 C13.1 39.37,57.27 IC1.175 | C6.1 40.78,58.98 IC1.172 | IC1.135 59.28,59.7 C5.1 58.42,61.38 C54.1 | C8.1 62.23,59.12 IC1.133 | C12.1 57.28,28.92 | 57.28,28.92 IC1.82 | C10.1 56.28,30.46 IC1.80 | IC1.40 36.73,35.62 33.68,35.62 | C4.1 30.85,35.61 33.64,35.61 | C52.1 32.38,47.2 IC1.17 | C50.1 57.41,28.79 57.28,28.92 | C28.1 58,60.11 58.78,59.33 IC1.136 | C26.1 50.78,58.82 IC1.152 | C24.1 46.78,59.9 IC1.160 | C22.1 37.53,58.42 IC1.176 | C20.1 34.29,51.65 34.29,49.53 34.62,49.2 IC1.13 | C18.1 35.85,52.63 35.85,52.45 36.11,52.2 IC1.7 | IC1.25 36.78,43.18 35.56,43.18 33.87,41.49 C16.1 | C30.1 35.56,32.45 IC1.44 | C32.1 40.28,29.15 IC1.48 | C34.1 48.78,29.31 IC1.65 | C36.1 51.78,29.77 IC1.71 | IC1.84 58.4,31.6 58.4,30.91 58.62,30.68 60.34,30.68 C38.1 | C40.1 66.1,35.2 IC1.92 | C42.1 65.86,38.7 IC1.99 | C46.1 63.94,45.7 IC1.113 | C44.1 64.05,52.2 IC1.126
VDD33USB
  Top 0.152: C48.1 64.32,49.7 IC1.121
VDD50USB
  Top 0.152: C47.1 65.06,49.2 IC1.120
VIN
  Top 0.152: IC1.16 30.34,47.7 C49.1 28.79,46.99 JP5.3
VLXSMPS
  Top 0.152: IC1.15 33.7,48.2 C51.1 30.86,48.88 L1.2
VREF
  Top 0.152: C15.1 33.33,36.1 36.7,36.1 IC1.39
VREFNF
  Top 0.152: C15.2 C14.1
VREFNF1
  Top 0.152: C3.1 C16.2
VREFNF2
  Top 0.152: C17.1 C18.2
VREFNF3
  Top 0.152: C19.1 C20.2
VREFNF4
  Top 0.152: C21.1 C22.2
VREFNF5
  Top 0.152: C23.1 C24.2
VREFNF6
  Top 0.152: C25.1 C26.2
VREFNF7
  Top 0.152: C27.1 C28.2
VREFNF8
  Top 0.152: C30.2 C29.1
VREFNF9
  Top 0.152: C32.2 C31.1
VREFNF10
  Top 0.152: C34.2 C33.1
VREFNF11
  Top 0.152: C36.2 C35.1
VREFNF12
  Top 0.152: C37.1 C38.2
VREFNF13
  Top 0.152: C39.1 C40.2
VREFNF14
  Top 0.152: C41.1 C42.2
VREFNF15
  Top 0.152: C43.1 C44.2
VREFNF16
  Top 0.152: C45.1 C46.2

### Text on the board
tNames: 1-2 = High / 2-3 = Low | BOOT0 | NRST | STDC14 for STLinkV3